# Altium schematic sheet mpa32iadapt.SchDoc
size A4
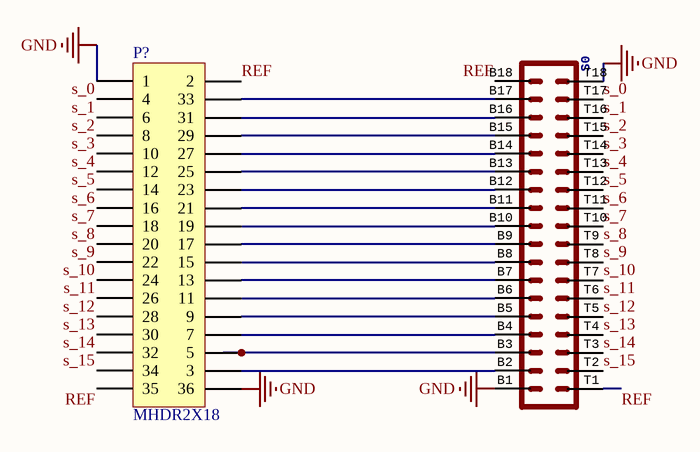
[diagram p0: mpa32iadapt.SchDoc]

## Parts
P?  MHDR2X18  [MHDR2X18]
S0  Omnetics A79024 36-pin connector  [OMNETICS_A79024]  (value not drawn)

## Nets
GND: P?.1 P?.36 S0.B1 S0.T18
REF: P?.2 P?.35 S0.B18 S0.T1
s_0: P?.4 S0.T17
s_1: P?.6 S0.T16
s_2: P?.8 S0.T15
s_3: P?.10 S0.T14
s_4: P?.12 S0.T13
s_5: P?.14 S0.T12
s_6: P?.16 S0.T11
s_7: P?.18 S0.T10
s_8: P?.20 S0.T9
s_9: P?.22 S0.T8
s_10: P?.24 S0.T7
s_11: P?.26 S0.T6
s_12: P?.28 S0.T5
s_13: P?.30 S0.T4
s_14: P?.32 S0.T3
s_15: P?.34 S0.T2
NetP?_3: P?.3 S0.B2
NetP?_5: P?.5 S0.B3
NetP?_7: P?.7 S0.B4
NetP?_9: P?.9 S0.B5
NetP?_11: P?.11 S0.B6
NetP?_13: P?.13 S0.B7
NetP?_15: P?.15 S0.B8
NetP?_17: P?.17 S0.B9
NetP?_19: P?.19 S0.B10
NetP?_21: P?.21 S0.B11
NetP?_23: P?.23 S0.B12
NetP?_25: P?.25 S0.B13
NetP?_27: P?.27 S0.B14
NetP?_29: P?.29 S0.B15
NetP?_31: P?.31 S0.B16
NetP?_33: P?.33 S0.B17

## Library data of the parts
P? = MHDR2X18: Header, 18-Pin, Dual row; LatestRevisionDate: 17-Jul-2002; LatestRevisionNote: Re-released for DXP Platform.; Publisher: Altium Limited
S0 = OMNETICS_A79024: GateName_1: A; SymbolName_1: OMNETICS_A7902X; LibraryName: RHD2000_eval_board; DeviceSetName: OMNETICS_A79024; Package: OMNETICS_A79024